# Altium schematic sheet [5] DC.SchDoc
size A4
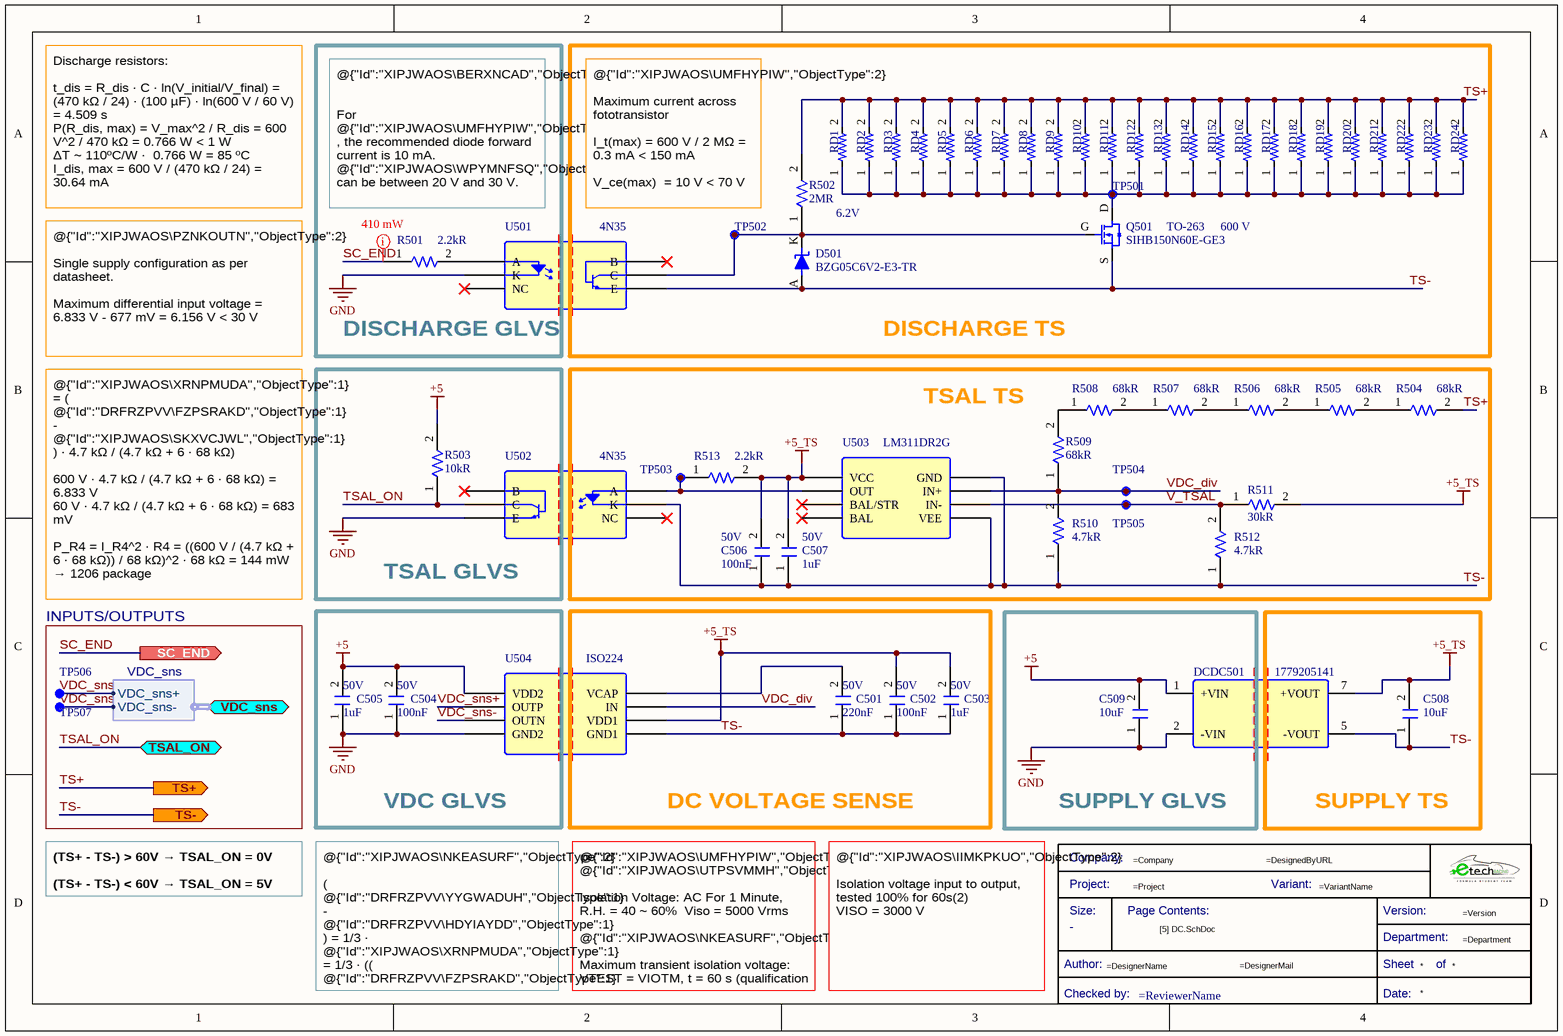
[diagram p0: [5] DC.SchDoc]

## Parts
*?  Title Block_template  (value not drawn)  (graphical)
C501  Voltage Rating: 50V  Capacitance: 220nF  [C0805FNPC-W]  (hidden comment: 885012208058)
C502  Voltage Rating: 50V  Capacitance: 100nF  [C0805FNPC-R]  (hidden comment: 885012207098)
C503  Voltage Rating: 50V  Capacitance: 1uF  [C0805FNPC-R]  (hidden comment: 885012207103)
C504  Voltage Rating: 50V  Capacitance: 100nF  [C0805FNPC-R]  (hidden comment: 885012207098)
C505  Voltage Rating: 50V  Capacitance: 1uF  [C0805FNPC-R]  (hidden comment: 885012207103)
C506  Voltage Rating: 50V  Capacitance: 100nF  [C0805FNPC-R]  (hidden comment: 885012207098)
C507  Voltage Rating: 50V  Capacitance: 1uF  [C0805FNPC-R]  (hidden comment: 885012207103)
C508  10uF  [C0805FNPC-W]
C509  10uF  [C0805FNPC-W]
D501  Zener Voltage: 6.2V  [DZ-6.2V-DO-214AC]  (hidden comment: BZG05C6V2-E3-TR)
DCDC501  1779205141  [1779205141]
Q501  SIHB150N60E-GE3  Vds(max): 600 V  Package: TO-263  [SIHB150N60E-GE3]
R501  Resistance: 2.2kR  [R1206FTK-W]  (hidden comment: CR1206-FX-2201ELF)
R502  Resistance: 2MR  [R2512FTK]  (hidden comment: R2M-2512FTK)
R503  Resistance: 10kR  [R1206FTK-W]  (hidden comment: CRCW120610K0FKEA)
R504  Resistance: 68kR  [R1206FTK-W]  (hidden comment: CR1206AFX-6802EAS)
R505  Resistance: 68kR  [R1206FTK-W]  (hidden comment: CR1206AFX-6802EAS)
R506  Resistance: 68kR  [R1206FTK-W]  (hidden comment: CR1206AFX-6802EAS)
R507  Resistance: 68kR  [R1206FTK-W]  (hidden comment: CR1206AFX-6802EAS)
R508  Resistance: 68kR  [R1206FTK-W]  (hidden comment: CR1206AFX-6802EAS)
R509  Resistance: 68kR  [R1206FTK-W]  (hidden comment: CR1206AFX-6802EAS)
R510  Resistance: 4.7kR  [R1206FTK-W]  (hidden comment: CRS1206-FX-4701ELF)
R511  Resistance: 30kR  [R1206FTK-W]  (hidden comment: CRCW120630K0FKEA)
R512  Resistance: 4.7kR  [R1206FTK-W]  (hidden comment: CRS1206-FX-4701ELF)
R513  Resistance: 2.2kR  [R1206FTK-W]  (hidden comment: CR1206-FX-2201ELF)
RD1  RCV2512470KFKEG  [R2512FTK]  (value not drawn)
RD2  RCV2512470KFKEG  [R2512FTK]  (value not drawn)
RD3  RCV2512470KFKEG  [R2512FTK]  (value not drawn)
RD4  RCV2512470KFKEG  [R2512FTK]  (value not drawn)
RD5  RCV2512470KFKEG  [R2512FTK]  (value not drawn)
RD6  RCV2512470KFKEG  [R2512FTK]  (value not drawn)
RD7  RCV2512470KFKEG  [R2512FTK]  (value not drawn)
RD8  RCV2512470KFKEG  [R2512FTK]  (value not drawn)
RD9  RCV2512470KFKEG  [R2512FTK]  (value not drawn)
RD10  RCV2512470KFKEG  [R2512FTK]  (value not drawn)
RD11  RCV2512470KFKEG  [R2512FTK]  (value not drawn)
RD12  RCV2512470KFKEG  [R2512FTK]  (value not drawn)
RD13  RCV2512470KFKEG  [R2512FTK]  (value not drawn)
RD14  RCV2512470KFKEG  [R2512FTK]  (value not drawn)
RD15  RCV2512470KFKEG  [R2512FTK]  (value not drawn)
RD16  RCV2512470KFKEG  [R2512FTK]  (value not drawn)
RD17  RCV2512470KFKEG  [R2512FTK]  (value not drawn)
RD18  RCV2512470KFKEG  [R2512FTK]  (value not drawn)
RD19  RCV2512470KFKEG  [R2512FTK]  (value not drawn)
RD20  RCV2512470KFKEG  [R2512FTK]  (value not drawn)
RD21  RCV2512470KFKEG  [R2512FTK]  (value not drawn)
RD22  RCV2512470KFKEG  [R2512FTK]  (value not drawn)
RD23  RCV2512470KFKEG  [R2512FTK]  (value not drawn)
RD24  RCV2512470KFKEG  [R2512FTK]  (value not drawn)
TP501  TestPoint  [TestPoint]  (value not drawn)  (no BOM)
TP502  TestPoint  [TestPoint]  (value not drawn)  (no BOM)
TP503  TestPoint  [TestPoint]  (value not drawn)  (no BOM)
TP504  TestPoint  [TestPoint]  (value not drawn)  (no BOM)
TP505  TestPoint  [TestPoint]  (value not drawn)  (no BOM)
TP506  TestPoint  [TestPoint]  (value not drawn)  (no BOM)
TP507  TestPoint  [TestPoint]  (value not drawn)  (no BOM)
U501  4N35  [Optocoupler_4N35]
U502  4N35  [Optocoupler_4N35]
U503  LM311DR2G  [LM311]
U504  ISO224  [ISO224]

## Blocks framed on the sheet
DISCHARGE GLVS: R501
DISCHARGE TS: D501 Q501 R502 RD1-RD24 TP501 TP502
TSAL GLVS: R503
TSAL TS: C506 C507 R504-R513 TP503-TP505 U503
INPUTS/OUTPUTS: TP506 TP507
VDC GLVS: C504 C505
DC VOLTAGE SENSE: C501-C503
SUPPLY GLVS: C509
SUPPLY TS: C508

## Ports
SC_END (out, see Inverter_Power[2C]), TS+ (out, see Inverter_Power[3C], [1] Power_Stage[3B], [4] Half_Bridge[3A]), TS- (out, see Inverter_Power[3C], [1] Power_Stage[3C]), TSAL_ON (bidir, see Inverter_Power[2C]), VDC_sns (bidir, harness VDC_sns, see Inverter_Power[2D])

## Harnesses
VDC_sns: VDC_sns+, VDC_sns-

## Nets
+5: C504.2 C505.2 C509.2 DCDC501.1(+VIN) R503.2 U504.8(VDD2)
+5_TS: C502.2 C503.2 C506.2 C507.2 C508.2 DCDC501.7(+VOUT) R511.2 R513.2 U503.8(VCC) U504.3(VDD1)
GND: C504.1 C505.1 C509.1 DCDC501.2(-VIN) U501.2(K) U502.4(E) U504.5(GND2)
SC_END: R501.1 ; port SC_END
TS+: R502.2 R504.2 RD1.2 RD2.2 RD3.2 RD4.2 RD5.2 RD6.2 RD7.2 RD8.2 RD9.2 RD10.2 RD11.2 RD12.2 RD13.2 RD14.2 RD15.2 RD16.2 RD17.2 RD18.2 RD19.2 RD20.2 RD21.2 RD22.2 RD23.2 RD24.2 ; port TS+
TS-: C501.1 C502.1 C503.1 C506.1 C507.1 C508.1 D501.A DCDC501.5(-VOUT) Q501.S R510.1 R512.1 U501.4(E) U502.2(K) U503.1(GND) U503.4(VEE) U504.4(GND1) ; port TS-
TSAL_ON: R503.1 U502.5(C) ; port TSAL_ON
V_TSAL: R511.1 R512.2 TP505.1(TP) U503.3(IN-)
VDC_div: R509.1 R510.2 TP504.1(TP) U503.2(IN+) U504.2(IN)
VDC_sns+: TP506.1(TP) U504.7(OUTP) ; port VDC_sns.VDC_sns+
VDC_sns-: TP507.1(TP) U504.6(OUTN) ; port VDC_sns.VDC_sns-
NetC501_2: C501.2 U504.1(VCAP)
NetD501_K: D501.K Q501.G R502.1 TP502.1(TP) U501.5(C)
NetQ501_D: Q501.D RD1.1 RD2.1 RD3.1 RD4.1 RD5.1 RD6.1 RD7.1 RD8.1 RD9.1 RD10.1 RD11.1 RD12.1 RD13.1 RD14.1 RD15.1 RD16.1 RD17.1 RD18.1 RD19.1 RD20.1 RD21.1 RD22.1 RD23.1 RD24.1 TP501.1(TP)
NetR501_2: R501.2 U501.1(A)
NetR504_1: R504.1 R505.2
NetR505_1: R505.1 R506.2
NetR506_1: R506.1 R507.2
NetR507_1: R507.1 R508.2
NetR508_1: R508.1 R509.2
NetR513_1: R513.1 TP503.1(TP) U502.1(A) U503.7(OUT)

Not connected (* = marked no-connect by the designer): U501 3(NC)* 6(B)*; U502 3(NC)* 6(B)*; U503 5(BAL)* 6(BAL/STR)*

## Layout directives
mark named 410 mW: SC_END

## Notes on the sheet
- Discharge resistors:
  t_dis = R_dis · C · ln(V_initial/V_final) = (470 kΩ / 24) · (100 µF) · ln(600 V / 60 V) = 4.509 s
  P(R_dis, max) = V_max^2 / R_dis = 600 V^2 / 470 kΩ = 0.766 W < 1 W
  ΔT ~ 110ºC/W ·  0.766 W = 85 ºC
  I_dis, max = 600 V / (470 kΩ / 24) = 30.64 mA
- @{"Id":"XIPJWAOS\BERXNCAD","ObjectType":2}
  For @{"Id":"XIPJWAOS\UMFHYPIW","ObjectType":2} , the recommended diode forward current is 10 mA. @{"Id":"XIPJWAOS\WPYMNFSQ","ObjectType":1} can be between 20 V and 30 V.
  I_min = 20 V / 2.2 kΩ= 9.1 mA
  I_max = 30 V / 2.2 kΩ = 13.6 mA
- @{"Id":"XIPJWAOS\UMFHYPIW","ObjectType":2}
  Maximum current across fototransistor
  I_t(max) = 600 V / 2 MΩ = 0.3 mA < 150 mA
  V_ce(max)  = 10 V < 70 V
- @{"Id":"XIPJWAOS\PZNKOUTN","ObjectType":2}
  Single supply configuration as per datasheet.
  Maximum differential input voltage = 6.833 V - 677 mV = 6.156 V < 30 V
- @{"Id":"XIPJWAOS\XRNPMUDA","ObjectType":1} = ( @{"Id":"DRFRZPVV\FZPSRAKD","ObjectType":1} - @{"Id":"XIPJWAOS\SKXVCJWL","ObjectType":1} ) · 4.7 kΩ / (4.7 kΩ + 6 · 68 kΩ)
  600 V · 4.7 kΩ / (4.7 kΩ + 6 · 68 kΩ) = 6.833 V
  60 V · 4.7 kΩ / (4.7 kΩ + 6 · 68 kΩ) = 683 mV
  P_R4 = I_R4^2 · R4 = ((600 V / (4.7 kΩ + 6 · 68 kΩ)) / 68 kΩ)^2 · 68 kΩ = 144 mW → 1206 package
  @{"Id":"XIPJWAOS\OXXSCXAN","ObjectType":1} = 5 V · 4.7 kΩ / (4.7 kΩ + 30 kΩ) = 677 mV ≡ 59.46 V in @{"Id":"DRFRZPVV\FZPSRAKD","ObjectType":1} - @{"Id":"XIPJWAOS\SKXVCJWL","ObjectType":1}
- (TS+ - TS-) > 60V → TSAL_ON = 0V
  (TS+ - TS-) < 60V → TSAL_ON = 5V
- @{"Id":"XIPJWAOS\NKEASURF","ObjectType":2}
  ( @{"Id":"DRFRZPVV\YYGWADUH","ObjectType":1} - @{"Id":"DRFRZPVV\HDYIAYDD","ObjectType":1} ) = 1/3 · @{"Id":"XIPJWAOS\XRNPMUDA","ObjectType":1} = 1/3 · (( @{"Id":"DRFRZPVV\FZPSRAKD","ObjectType":1} - @{"Id":"XIPJWAOS\SKXVCJWL","ObjectType":1} ) 4.7 kΩ / (4.7 kΩ + 6 · 68 kΩ)) = 1/3 · 0.011388 · ( @{"Id":"XIPJWAOS\KHFIDXAO","ObjectType":1} - @{"Id":"XIPJWAOS\SKXVCJWL","ObjectType":1} )
  ( @{"Id":"DRFRZPVV\YYGWADUH","ObjectType":1} - @{"Id":"DRFRZPVV\HDYIAYDD","ObjectType":1} ) = 1/3 · 0.011388 · 600 V = 2.278 V
- @{"Id":"XIPJWAOS\UMFHYPIW","ObjectType":2}, @{"Id":"XIPJWAOS\UTPSVMMH","ObjectType":2}
  Isolation Voltage: AC For 1 Minute, R.H. = 40 ~ 60%  Viso = 5000 Vrms
  @{"Id":"XIPJWAOS\NKEASURF","ObjectType":2}
  Maximum transient isolation voltage: VTEST = VIOTM, t = 60 s (qualification test) VIOTM = 7071 Vpk
- (near *?) @{"Id":"XIPJWAOS\IIMKPKUO","ObjectType":2}
  Isolation voltage input to output, tested 100% for 60s(2)
  VISO = 3000 V
- (in symbol Title Block_template) Company:; Project:; Variant:; Size:; Page Contents:; Version:; Department:; Author:; Sheet; of; Checked by:; Date:

## Library data of the parts
*? = Title Block_template: Standard Title Block; .Creator: GP; Category: Title Block; .PCBcheck: GP; .SCHcheck: GP; Checked by:: =ReviewerName; Size: -
C501 = C0.22u-0805FNPC-X5R: Cap Ceramic 0.22uF 50V X5R 10% Pad SMD 0805 85C Low ESR Automotive T/R; Manufacturer: Taiyo Yuden; Manufacturer Part Number: UMK212BJ224KGHT; .Creator: DR; Category: Capacitor; ComponentLink1Description: Datasheet; ComponentLink1URL: https://eu.mouser.com/datasheet/2/396/taiyo_yuden_12132018_mlcc11_hq_e-1510082.pdf; ComponentLink2Description: Where buy it; ComponentLink2URL: https://eu.mouser.com/ProductDetail/Taiyo-Yuden/UMK212BJ224KGHT?qs=CNQs48zzdnpf%2FbZJTfp33Q%3D%3D; Supplier 1: Digi-Key; RoHS: Yes; Stock 1: 900; Pricing 1: 1=0,20000, 10=0,13700, 50=0,08220, 100=0,06950, 500=0,04754, 1000=0,04206 (USD); Mount: Surface Mount; Case/Package: 0805; Case Code (Metric): 2012; Case Code (Imperial): 0805; Min Operating Temperature: -55°C; Max Operating Temperature: 85°C; Package Quantity: 3000; Packaging: Tape and Reel; Tolerance: 10%; Voltage Rating (DC): 50V; Dielectric: X5R; Termination: SMD/SMT; Length: 0.079inch; Width: 0.049inch; Height: 1.25mm; Thickness: 0.053inch; Ratings: AEC-Q200; Lead Free: Lead Free; Halogen Free: Halogen Free; RoHS Compliant: Yes; Supplier Part Number 1: 587-3514-1-ND
C502 C504 C506 = C100n-50V-0805FNPC-X7R: Cap, 0.1ΜF, 50V, 10%, X7R, 0805; Manufacturer 1: Wurth Electronics; .Creator: DR; Supplier 1: RSComponents; Manufacturer Part Number 1: 885012207098; RoHS: Yes; Category: Ceramic Capacitors; Stock 1: 8000; Pricing 1: 100=0,10200, 500=0,07100, 2000=0,06100 (GBP); Mount: Surface Mount; Case/Package: 0805; Case Code (Metric): 2012; Case Code (Imperial): 0805; Min Operating Temperature: -55°C; Max Operating Temperature: 125°C; Packaging: Cut Tape; Dielectric: X7R; Tolerance: 10%; Voltage Rating (DC): 50V; Length: 0.079inch; Width: 0.049inch; Thickness: 0.035inch; REACH SVHC: Unknown; RoHS Compliant: Yes; ComponentLink1URL: http://www.farnell.com/datasheets/1958498.pdf?src-supplier=Farnell; ComponentLink1Description: http://www.farnell.com/datasheets/1958498.pdf?src-supplier=Farnell; ComponentLink2URL: http://www.farnell.com/datasheets/1958498.pdf?src-supplier=Element14; ComponentLink2Description: http://www.farnell.com/datasheets/1958498.pdf?src-supplier=Element14; ComponentLink3URL: https://katalog.we-online.de/pbs/datasheet/885012207098.pdf?src-supplier=Digi-Key; ComponentLink3Description: https://katalog.we-online.de/pbs/datasheet/885012207098.pdf?src-supplier=Digi-Key; ComponentLink4URL: http://www.farnell.com/datasheets/1958498.pdf?src-supplier=Newark; ComponentLink4Description: http://www.farnell.com/datasheets/1958498.pdf?src-supplier=Newark; Supplier Part Number 1: 1813493
C503 C505 C507 = C1u-50V-0805FNPC-X7R: Multilayer Ceramic Capacitor, Wcap-Csgp Series, 1 F, 10%, X7R, 50 V, 0805 [2012 Metric] Rohs Compliant: Yes; Manufacturer 1: Wurth Electronics; .Creator: GP; Supplier 1: RSComponents; Manufacturer Part Number 1: 885012207103; RoHS: Yes; Category: Ceramic Capacitors; Stock 1: 5100; Pricing 1: 50=0,27200, 250=0,25300, 500=0,22800, 1250=0,20100, 2500=0,17100 (GBP); Mount: Surface Mount; Case/Package: 0805; Case Code (Metric): 2012; Case Code (Imperial): 0805; Min Operating Temperature: -55°C; Max Operating Temperature: 85°C; Packaging: Cut Tape; Dielectric: X7R; Tolerance: 10%; Voltage Rating (DC): 50V; Length: 0.079inch; Width: 0.049inch; Thickness: 0.053inch; REACH SVHC: Unknown; RoHS Compliant: Yes; ComponentLink1URL: http://www.farnell.com/datasheets/1958501.pdf?src-supplier=Farnell; ComponentLink1Description: http://www.farnell.com/datasheets/1958501.pdf?src-supplier=Farnell; ComponentLink2URL: http://www.farnell.com/datasheets/1958501.pdf?src-supplier=Element14; ComponentLink2Description: http://www.farnell.com/datasheets/1958501.pdf?src-supplier=Element14; ComponentLink3URL: https://katalog.we-online.de/pbs/datasheet/885012107003.pdf?src-supplier=Digi-Key; ComponentLink3Description: https://katalog.we-online.de/pbs/datasheet/885012107003.pdf?src-supplier=Digi-Key; ComponentLink4URL: http://www.farnell.com/datasheets/1958501.pdf?src-supplier=Newark; ComponentLink4Description: http://www.farnell.com/datasheets/1958501.pdf?src-supplier=Newark; Supplier Part Number 1: 1813523
C508 C509 = C10uF-50V-0805FNPC
D501 = DZ-6.2V-DO-214AC: BZG05C Series 6.2 V 200 mA Surface Mount Zener Diode - DO-214AC; Manufacturer 1: Vishay Semiconductors; Max Power Dissipation: 1.25W; Impedance: 4R; Max Reverse Leakage Current: 1uA; Tolerance: 5%; Test Current: 35mA; .Creator: DO; ComponentLink1Description: Datasheet; ComponentLink1URL: http://www.mouser.com/ds/2/427/bzg05c-710097.pdf?src-supplier=Mouser; ComponentLink3URL: http://www.mouser.com/ds/2/427/bzg05c-710097.pdf?src-supplier=Mouser; ComponentLink3Description: http://www.mouser.com/ds/2/427/bzg05c-710097.pdf?src-supplier=Mouser; ComponentLink4URL: http://www.vishay.com/docs/85893/bzg05c.pdf?src-supplier=Avnet; ComponentLink4Description: http://www.vishay.com/docs/85893/bzg05c.pdf?src-supplier=Avnet; ComponentLink5URL: http://www.vishay.com/docs/85893/bzg05c.pdf?src-supplier=Digi-Key; ComponentLink5Description: http://www.vishay.com/docs/85893/bzg05c.pdf?src-supplier=Digi-Key; Supplier 1: Farnell; Supplier Part Number 1: 2690001; Manufacturer Part Number 1: BZG05C6V2-E3-TR; RoHS: Yes; Category: Zener Diodes; Pricing 1: 1=0,06810 (GBP); RoHS Compliant: Yes; ComponentLink2Description: Where buy it; ComponentLink2URL: https://www.mouser.es/ProductDetail/Vishay-Semiconductors/BZG05C6V2-E3-TR?qs=PhR8RmCirEbIeyTQuBsADg%3D%3D; Mount: Surface Mount; Number of Pins: 2; Contact Plating: Tin,Matte; Min Operating Temperature: -65°C; Max Operating Temperature: 150°C; Packaging: Tape and Reel; Lead Free: Lead Free
DCDC501 = 1779205141: WPME-FISM Fixed Isolated Module, SIP-7, 5Vin, 5Vout; Manufacturer: Wurth Elektronik; Input Voltage: 5V; Input Voltage Min: 4.5V; Input Voltage Max: 5.5V; Isolation Voltage: 3000V; Output Power: 1W; Manufacturer Part Number: 1779205141; Category: Isolated Converter; Match Code: WPME-FISM; ComponentLink1Description: Website Link; ComponentLink1URL: https://www.we-online.com/redexpert/article/1779205141?ad; ComponentLink2Description: Datasheet Link; ComponentLink2URL: https://www.we-online.com/redexpert/spec/1779205141?ad; Mount: Through Hole; Operating Temperature Max: 105°C; Operating Temperature Min: -40°C; Packaging: Tube; Case/Size Code: SIP-7; Length: 19.65mm; Width: 6mm; Height: 10.16mm; Output Voltage: 5V
Q501 = SIHB150N60E-GE3: Mosfet, N-ch, 600V, 22A, TO-263 Rohs Compliant: Yes; Manufacturer 1: Vishay; Vgs(typ): 10 V; Supplier 1: Digi-Key; Stock 1: 1000; Pricing 1: 1=3,670000, 10=3,081000, 100=2,492500, 500=2,215540 (USD); Supplier Part Number 1: 742-SIHB150N60E-GE3CT-ND; Ids(max): 22 A; Manufacturer Part Number 1: SIHB150N60E-GE3
R501 R513 = R2.2K-1206FTK: Res Thick Film 1206 2.2K Ohm 1% 1/4W ±100ppm/°C Molded SMD SMD Paper Tape on Plastic Reel; Manufacturer 1: Bourns; Power Rating: 250mW; Voltage Rating: 200V; .Creator: AC; Supplier 1: Digi-Key; Manufacturer Part Number 1: CR1206-FX-2201ELF; RoHS: Yes; Category: Chip SMD Resistors; Stock 1: 150; Pricing 1: 1=0,10000, 10=0,04200, 100=0,01700, 1000=0,00762, 2500=0,00661 (USD); Mount: Surface Mount; Case/Package: 1206; Number of Pins: 2; Contact Plating: Tin; Case Code (Metric): 3216; Case Code (Imperial): 1206; Min Operating Temperature: -55°C; Max Operating Temperature: 155°C; Tolerance: 1%; Resistor Type: Thick Film; Temperature Coefficient: 100ppm/°C; Packaging: Tape and Reel; Package Quantity: 5000; Number of Terminations: 2; Termination: SMD/SMT; Max Power Dissipation: 250mW; Voltage Rating (DC): 200V; Features: Moisture Resistant; Series: CR1206; Resistance Tolerance: 1%; Construction: Rectangular; Technology: THICK FILM; Length: 3.2mm; Width: 1.6mm; Height: 0.6mm; Depth: 1.6mm; Thickness: 610um; Radiation Hardening: No; REACH SVHC: No SVHC; Military Standard: Not; RoHS Compliant: Yes; ComponentLink1URL: https://datasheet.ciiva.com/11809/0900766b80fcdb72-11809898.pdf?src-supplier=RSComponents; ComponentLink1Description: https://datasheet.ciiva.com/11809/0900766b80fcdb72-11809898.pdf?src-supplier=RSComponents; ComponentLink2URL: https://datasheet.ciiva.com/9123/chpreztr-9123227.pdf?src-supplier=Avnet; ComponentLink2Description: https://datasheet.ciiva.com/9123/chpreztr-9123227.pdf?src-supplier=Avnet; ComponentLink3URL: https://datasheet.ciiva.com/16770/70154685-16770447.pdf?src-supplier=Allied+Electronics; ComponentLink3Description: https://datasheet.ciiva.com/16770/70154685-16770447.pdf?src-supplier=Allied+Electronics; ComponentLink4URL: https://datasheet.ciiva.com/7985/1856384-7985879.pdf?src-supplier=Element14; ComponentLink4Description: https://datasheet.ciiva.com/7985/1856384-7985879.pdf?src-supplier=Element14; ComponentLink5URL: https://datasheet.ciiva.com/22693/1902866-22693258.pdf?src-supplier=Element14; ComponentLink5Description: https://datasheet.ciiva.com/22693/1902866-22693258.pdf?src-supplier=Element14; Supplier Part Number 1: CR1206-FX-2201ELFCT-ND; ComponentLink6Description: RS; ComponentLink6URL: https://es.rs-online.com/web/p/resistencias-fijas-para-montaje-en-superficie/7409097/
R502 = R2M-2512FTK: Current Sense Resistors - SMD 3watts .002ohms 1%; Manufacturer: Vishay Dale; Manufacturer Part Number: WSLP25122L000FEA; Temperature Coefficient: 275ppm/°C; Power Rating: 3W; Supplier 1: Mouser; RoHS: Yes; Category: Chip SMD Resistors; Stock 1: 11994; Pricing 1: 1=1,07000, 10=1,07000, 50=1,07000, 100=1,07000, 1000=0,77100, 10000=0,75500 (USD); Mount: Surface Mount; Case/Package: 2512; Case Code (Imperial): 2512; Case Code (Metric): 6432; Weight: 0.001429oz; Size Code: 2512; Min Operating Temperature: -65°C; Max Operating Temperature: 170°C; Tolerance: 1%; Packaging: Tape and Reel; Resistor Type: Metal Strip; Package Quantity: 2000; Termination: SMD/SMT; Series: WSLP; Length: 6.4mm; Width: 3.2mm; Height: 0.635mm; RoHS Compliant: Yes; Lead Free: Lead Free; ComponentLink1URL: https://datasheet.ciiva.com/48527/wslp-48527354.pdf?src-supplier=Avnet; ComponentLink1Description: https://datasheet.ciiva.com/48527/wslp-48527354.pdf?src-supplier=Avnet; Supplier Part Number 1: 71-WSLP25122L000FEA
R503 = R10k-1206FTK: Res Thick Film 1206 10K Ohm 1% 0.25W(1/4W) +/-100ppm/ßC Pad SMD Automotive T/R; Temperature Coefficient: 100ppm/°C; Voltage Rating: 200V; .Creator: GP; Category: Resistor; ComponentLink1Description: Datasheet; ComponentLink1URL: https://docs.rs-online.com/bca8/A700000006404581.pdf; ComponentLink2Description: Where buy it; ComponentLink2URL: https://es.rs-online.com/web/p/resistencias-de-montaje-en-superficie/6791765; Supplier 1: Allied Electronics; Case/Package: 1206; Number of Pins: 2; Contact Plating: Tin; Weight: 0.000353oz; Case Code (Metric): 3216; Case Code (Imperial): 1206; Package Shape: Rectangular; Size Code: 1206; Terminal Finish: Tin; Resistor Type: Thick Film; Package Quantity: 10; Number of Terminations: 2; Termination: SMD/SMT; Voltage Rating (DC): 200V; Features: Automotive AEC-Q200; Series: CRCW; Construction: Rectangular; Resistance Tolerance: 1%; Working Voltage: 200V; Length: 3.2mm; Width: 0.063inch; Height: 0.55mm; Depth: 1.6mm; Radiation Hardening: No; Lead Free: Lead Free; RoHS Compliant: Yes; REACH SVHC: Unknown; Military Standard: Not; Supplier Part Number 1: 70201262
R504-R509 = R68k-1206FTK: Resistor, AS 1206 68k1% 250mW TC100; Manufacturer: Bourns; .Creator: DO; Supplier 1: Newark; Manufacturer Part Number: CR1206AFX-6802EAS; RoHS: Yes; Category: Chip SMD Resistors; Stock 1: 4700; Pricing 1: 1=0,01100, 25=0,01100, 50=0,01100, 100=0,01100, 250=0,01100, 500=0,01100 (USD); Supplier Part Number 1: 16AH0632; ComponentLink1Description: Where buy it; ComponentLink1URL: https://www.mouser.es/ProductDetail/Bourns/CR1206AFX-6802EAS?qs=PzGy0jfpSMtMA5jyzS7M7w%3D%3D; ComponentLink2Description: Datasheet; ComponentLink2URL: https://www.mouser.es/datasheet/2/54/cr_a_as-1858644.pdf
R510 R512 = R4.7K-1206FTK: Res Thick Film 1206 4.7K Ohm 1% 1/2W ±100ppm/°C Molded SMD T/R; Manufacturer 1: Bourns JW Miller; Voltage Rating: 400V; Power Rating: 500mW; .Creator: AC; Supplier 1: Digi-Key; RoHS: Yes; Category: Chip SMD Resistors; Pricing 1: 1=0,42000, 10=0,35400, 100=0,13850, 1000=0,05796, 2500=0,05313 (USD); Mount: Surface Mount; Case/Package: 1206; Case Code (Metric): 3016; Case Code (Imperial): 1206; Min Operating Temperature: -55°C; Max Operating Temperature: 155°C; Packaging: Cut Tape; Resistor Type: Thick Film; Number of Terminations: 2; Termination: SMD/SMT; Working Voltage: 400V; Voltage Rating (DC): 400V; Tolerance: 1%; Max Power Dissipation: 500mW; Temperature Coefficient: 100ppm/°C; Length: 0.122inch; Width: 0.063inch; Height: 0.026inch; REACH SVHC: No SVHC; ComponentLink1URL: https://datasheet.ciiva.com/48986/70483705-48986735.pdf?src-supplier=Allied+Electronics; ComponentLink1Description: https://datasheet.ciiva.com/48986/70483705-48986735.pdf?src-supplier=Allied+Electronics; Supplier Part Number 1: CRS1206-FX-4701ELFCT-ND; ComponentLink3Description: RS; ComponentLink3URL: https://es.rs-online.com/web/p/resistencias-de-montaje-en-superficie/8672965; Manufacturer Part Number 1: CRS1206-FX-4701ELF
R511 = R30k-1206FTK: Res Thick Film 1206 30K Ohm 1% 1/4W ±100ppm/°C Molded SMD SMD Paper T/R; Manufacturer: Vishay; Power Rating: 250mW; Voltage Rating: 200V; .Creator: GP; Category: Resistor; ComponentLink1Description: Datasheet; ComponentLink1URL: https://docs.rs-online.com/bca8/A700000006404581.pdf; ComponentLink2Description: Where buy it; ComponentLink2URL: https://es.rs-online.com/web/p/resistencias-de-montaje-en-superficie/6792039; Supplier 1: RSComponents; Manufacturer Part Number: CRCW120630K0FKEA; RoHS: Yes; Stock 1: 3550; Pricing 1: 50=0,12000, 500=0,11200, 1000=0,10400, 2000=0,09700, 4000=0,08900 (USD); Case/Package: 1206; Number of Pins: 2; Contact Plating: Tin; Case Code (Imperial): 1206; Case Code (Metric): 3216; Weight: 0.000353oz; Size Code: 1206; Min Operating Temperature: -55°C; Max Operating Temperature: 155°C; Tolerance: 1%; Resistor Type: Thick Film; Packaging: Tape and Reel; Temperature Coefficient: 100ppm/°C; Package Quantity: 10; Termination: SMD/SMT; Number of Terminations: 2; Max Power Dissipation: 250mW; Features: Automotive AEC-Q200; Series: CRCW; Construction: Rectangular; Resistance Tolerance: 1%; Technology: THICK FILM; Length: 3.2mm; Width: 1.6mm; Height: 0.55mm; Depth: 1.6mm; Radiation Hardening: No; RoHS Compliant: Yes; REACH SVHC: Unknown; Military Standard: Not; Supplier Part Number 1: 6792039
RD1-RD24 = RCV2512470KFKEG: RCV2512 100 470K 1% E67 E3; Manufacturer: Vishay Dale; Power rating: 1 W; Maximum voltage: 3 kV; Supplier: Mouser; Supplier Part Number: 71-RCV2512470KFKEG; Manufacturer Part Number: RCV2512470KFKEG; RoHS: No; Category: Chip SMD Resistors; Stock: 1093; Pricing: 1=0,89, 10=0,732, 50=0,732, 100=0,54, 1000=0,317, 10000=0,287 (USD)
TP501-TP507 = TestPoint: Test Point 1x1 mm; .Creator: GP; Category: TestPoint; .PCBcheck: GP; .SCHcheck: GP
U501 U502 = Optocoupler_4N35: Optocoupler DC-IN 1-CH Transistor With Base DC-OUT 6-Pin PDIP SMD T/R; Manufacturer: Vishay Lite-On; Manufacturer Part Number: CNY17-4S-TA1; Number of Channels: 1; Max Power Dissipation: 250mW; Isolation Voltage: 5kV; Output Voltage: 70V; Forward Voltage: 1.65V; Rise Time: 10000ns; Collector Emitter Saturation Voltage: 300mV; Max Input Current: 60mA; Reverse Breakdown Voltage: 6V; Input Type: DC; Current Transfer Ratio: 320%; Output Current per Channel: 150mA; .Creator: DO; Supplier 1: RSComponents; RoHS: Yes; Category: Optocouplers; Stock 1: 1; Pricing 1: 50=0,27200, 250=0,25600, 500=0,24000, 1250=0,22500, 2500=0,21200 (USD); Mount: Surface Mount; Case/Package: SMD/SMT; Number of Pins: 6; Min Operating Temperature: -55°C; Max Operating Temperature: 100°C; Packaging: Tape and Reel; Package Quantity: 1000; Power Dissipation: 250mW; Collector Emitter Voltage (VCEO): 70V; Max Output Voltage: 70V; Number of Elements: 1; Series: -; Forward Current: 60mA; Collector-emitter Voltage-Max: 300mV; Fall Time: 10000ns; Number of Circuits: 1; Max Collector Current: 150mA; Radiation Hardening: No; Lead Free: Lead Free; RoHS Compliant: Yes; ComponentLink1URL: https://datasheet.ciiva.com/15118/getdatasheetpartid-187668-15118874.pdf?src-supplier=Verical; ComponentLink1Description: https://datasheet.ciiva.com/15118/getdatasheetpartid-187668-15118874.pdf?src-supplier=Verical; ComponentLink2URL: https://datasheet.ciiva.com/6573/s-110-cny17-6573733.pdf?src-supplier=Digi-Key; ComponentLink2Description: https://datasheet.ciiva.com/6573/s-110-cny17-6573733.pdf?src-supplier=Digi-Key; Supplier Part Number 1: 1278380P; ComponentLink3Description: Where buy it; ComponentLink3URL: https://es.rs-online.com/web/p/circuitos-integrados-optoacopladores/1257571
U503 = LM311DR2G: LM Series 36 V 300 nA Surface Mount Single Comparator - SOIC-8; Manufacturer 1: ON Semiconductor; Supplier 1: Future Electronics; Manufacturer Part Number 1: LM311DR2G; RoHS: Yes; Category: Comparators; Stock 1: 35000; Pricing 1: 2500=0,145, 5000=0,142, 10000=0,139, 12500=0,138, 37500=0,133 (USD); Supplier Part Number 1: 9254327
U504 = ISO224: Reinforced isolated amplifier for voltage sensing with ±12-V input 8-SOIC -55 to 125; Manufacturer 1: Texas Instruments; Manufacturer Part Number 1: ISO224ADWVR; Supplier 1: Mouser; RoHS: Yes; Category: Amplifiers - Op Amps, Buffer, Instrumentation; Stock 1: 3377; Pricing 1: 1=13,32, 10=12,25, 50=11,74, 100=10,35, 1000=8,44, 10000=8,44 (USD); ComponentLink1URL: https://www.ti.com/lit/ds/symlink/iso224.pdf?ts=1702215020753&ref_url=https%253A%252F%252Fwww.ti.com%252Fproduct%252Fes-mx%252FISO224; ComponentLink1Description: Datasheet; Supplier Part Number 1: 595-ISO224ADWVR